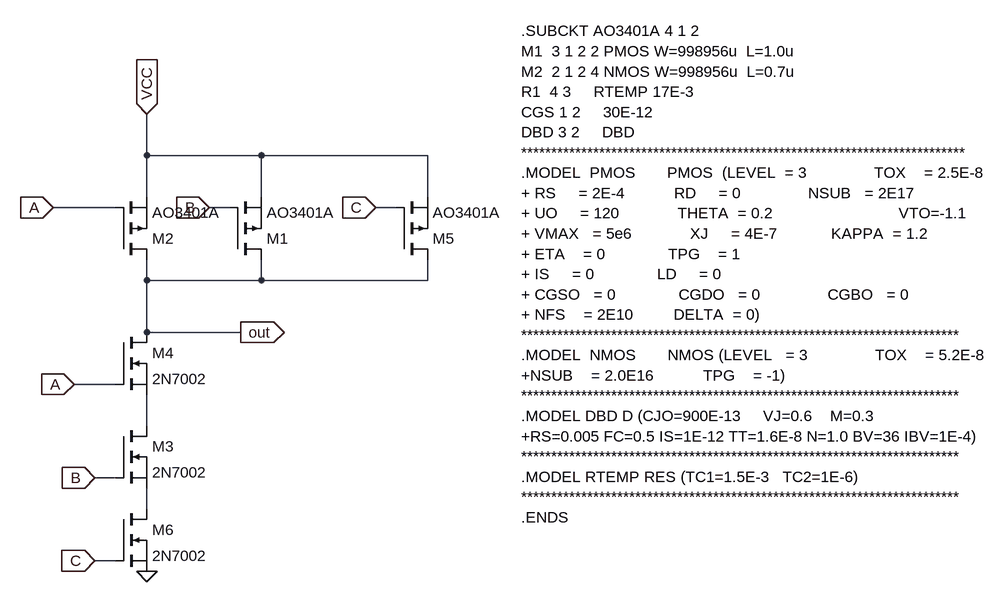
[diagram p0: schematic nand3-gate.asc]
nand3-gate.asc, the LTspice schematic file:
Version 4.1
SHEET 1 2000 824
WIRE 336 128 336 64
WIRE 512 128 336 128
WIRE 768 128 512 128
WIRE 336 192 336 128
WIRE 512 192 512 128
WIRE 768 192 768 128
WIRE 288 208 192 208
WIRE 464 208 432 208
WIRE 720 208 688 208
WIRE 336 320 336 288
WIRE 512 320 512 288
WIRE 512 320 336 320
WIRE 768 320 768 288
WIRE 768 320 512 320
WIRE 336 400 336 320
WIRE 480 400 336 400
WIRE 288 480 224 480
WIRE 336 544 336 496
WIRE 288 624 256 624
WIRE 336 672 336 640
WIRE 288 752 256 752
FLAG 192 208 A
IOPIN 192 208 In
FLAG 224 480 A
IOPIN 224 480 In
FLAG 432 208 B
IOPIN 432 208 In
FLAG 256 624 B
IOPIN 256 624 In
FLAG 480 400 out
IOPIN 480 400 Out
FLAG 256 752 C
IOPIN 256 752 In
FLAG 688 208 C
IOPIN 688 208 In
FLAG 336 768 0
FLAG 336 64 VCC
IOPIN 336 64 In
SYMBOL pmos 464 288 M180
SYMATTR InstName M1
SYMATTR Value AO3401A
SYMATTR Prefix X
SYMBOL pmos 288 288 M180
SYMATTR InstName M2
SYMATTR Value AO3401A
SYMATTR Prefix X
SYMBOL nmos 288 400 R0
SYMATTR InstName M4
SYMATTR Value 2N7002
SYMBOL nmos 288 544 R0
SYMATTR InstName M3
SYMATTR Value 2N7002
SYMBOL pmos 720 288 M180
SYMATTR InstName M5
SYMATTR Value AO3401A
SYMATTR Prefix X
SYMBOL nmos 288 672 R0
SYMATTR InstName M6
SYMATTR Value 2N7002
TEXT 912 -64 Left 2 !.SUBCKT AO3401A 4 1 2\nM1  3 1 2 2 PMOS W=998956u  L=1.0u \nM2  2 1 2 4 NMOS W=998956u  L=0.7u\nR1  4 3     RTEMP 17E-3\nCGS 1 2     30E-12\nDBD 3 2     DBD\n**************************************************************************\n.MODEL  PMOS       PMOS  (LEVEL  = 3               TOX    = 2.5E-8\n+ RS     = 2E-4           RD     = 0               NSUB   = 2E17  \n+ UO     = 120             THETA  = 0.2                            VTO=-1.1\n+ VMAX   = 5e6             XJ     = 4E-7            KAPPA  = 1.2\n+ ETA    = 0              TPG    = 1  \n+ IS     = 0              LD     = 0                           \n+ CGSO   = 0              CGDO   = 0               CGBO   = 0 \n+ NFS    = 2E10         DELTA  = 0)\n*************************************************************************\n.MODEL  NMOS       NMOS (LEVEL   = 3               TOX    = 5.2E-8\n+NSUB    = 2.0E16           TPG    = -1)   \n*************************************************************************\n.MODEL DBD D (CJO=900E-13     VJ=0.6    M=0.3\n+RS=0.005 FC=0.5 IS=1E-12 TT=1.6E-8 N=1.0 BV=36 IBV=1E-4)\n*************************************************************************\n.MODEL RTEMP RES (TC1=1.5E-3   TC2=1E-6)\n*************************************************************************\n.ENDS

The netlist it stands for:
* nand3-gate.asc
X§M1 out B VCC AO3401A  ; pins D G S
X§M2 out A VCC AO3401A  ; pins D G S
M4 out A N001 N001 2N7002
M3 N001 B N002 N002 2N7002
X§M5 out C VCC AO3401A  ; pins D G S
M6 N002 C 0 0 2N7002
.model NMOS NMOS
.model PMOS PMOS
.lib standard.mos
.SUBCKT AO3401A 4 1 2
M1  3 1 2 2 PMOS W=998956u  L=1.0u
M2  2 1 2 4 NMOS W=998956u  L=0.7u
R1  4 3     RTEMP 17E-3
CGS 1 2     30E-12
DBD 3 2     DBD
**************************************************************************
.MODEL  PMOS       PMOS  (LEVEL  = 3               TOX    = 2.5E-8
+ RS     = 2E-4           RD     = 0               NSUB   = 2E17
+ UO     = 120             THETA  = 0.2                            VTO=-1.1
+ VMAX   = 5e6             XJ     = 4E-7            KAPPA  = 1.2
+ ETA    = 0              TPG    = 1
+ IS     = 0              LD     = 0
+ CGSO   = 0              CGDO   = 0               CGBO   = 0
+ NFS    = 2E10         DELTA  = 0)
*************************************************************************
.MODEL  NMOS       NMOS (LEVEL   = 3               TOX    = 5.2E-8
+NSUB    = 2.0E16           TPG    = -1)
*************************************************************************
.MODEL DBD D (CJO=900E-13     VJ=0.6    M=0.3
+RS=0.005 FC=0.5 IS=1E-12 TT=1.6E-8 N=1.0 BV=36 IBV=1E-4)
*************************************************************************
.MODEL RTEMP RES (TC1=1.5E-3   TC2=1E-6)
*************************************************************************
.ENDS
.backanno
.end